# EAGLE design drsstc (EAGLE 9.2.0)
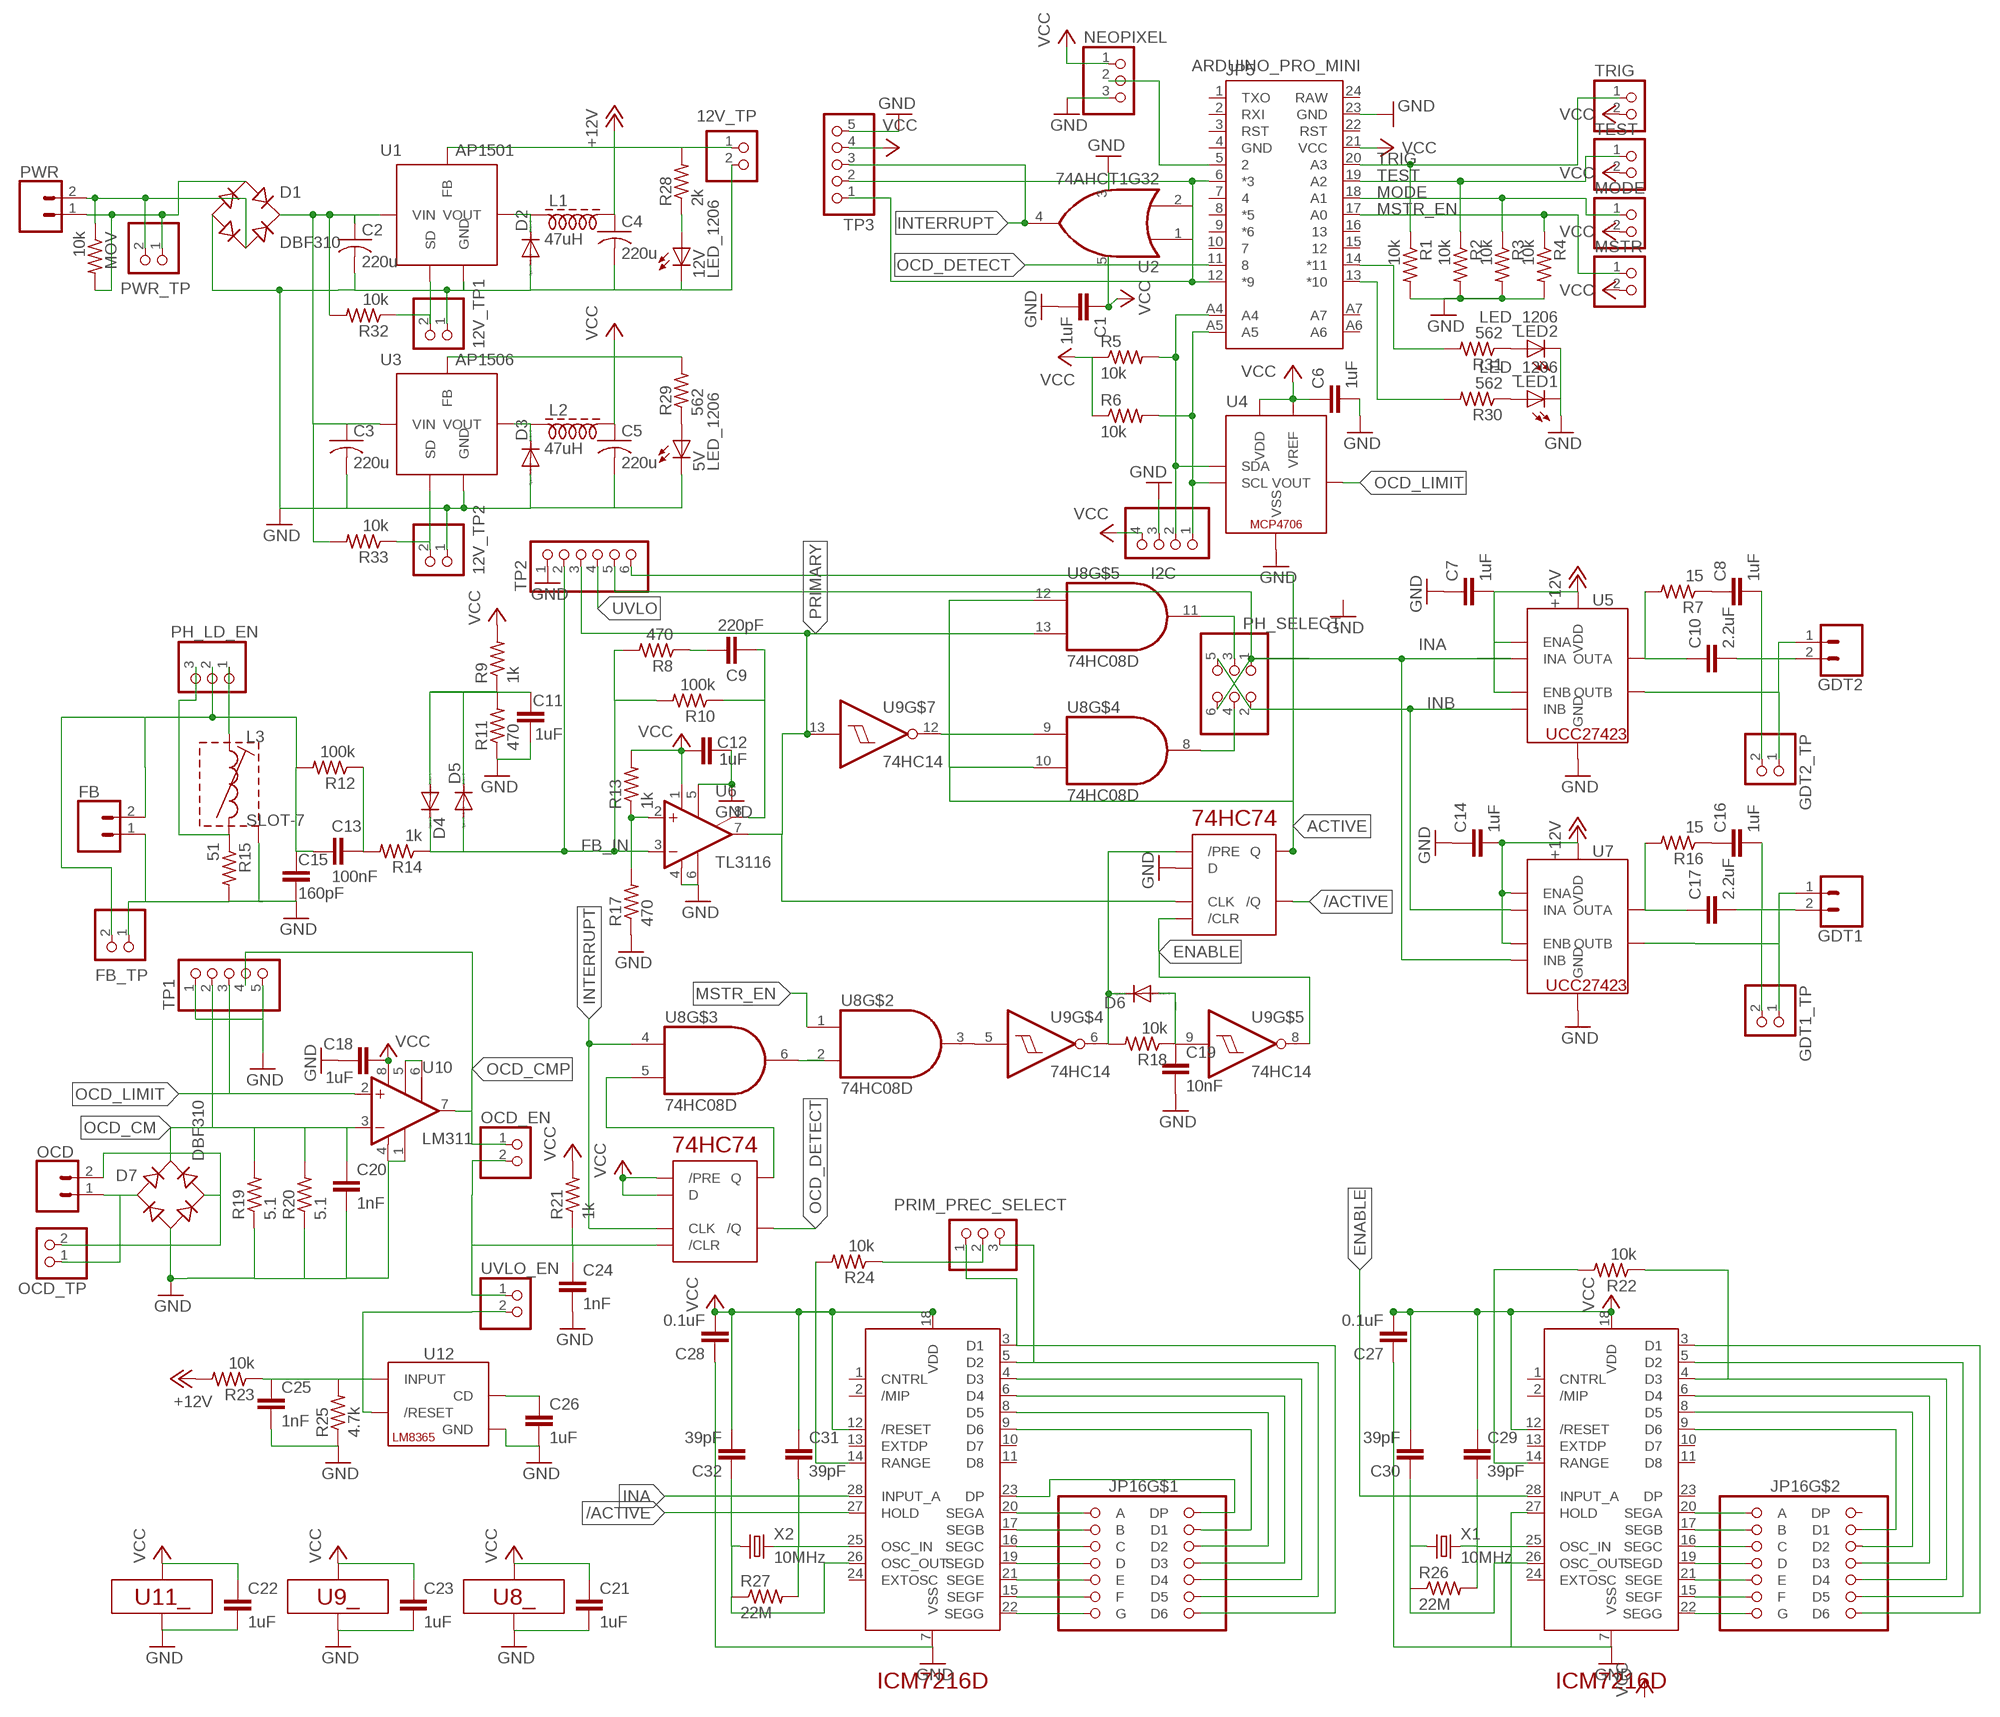
[diagram p0: schematic, sheet 1]

## Parts
5V  LED_1206  [CHIPLED_1206]
12V  LED_1206  [CHIPLED_1206]
12V_TP  PINHD-1X2  [1X02]
12V_TP1  PINHD-1X2  [1X02]
12V_TP2  PINHD-1X2  [1X02]
C1  1uF  C-EUC1206  [C1206]
C2  220u  UWT1V221MNL1GS  [CAPAE830X1050]
C3  220u  UWT1V221MNL1GS  [CAPAE830X1050]
C4  220u  UWT1V221MNL1GS  [CAPAE830X1050]
C5  220u  UWT1V221MNL1GS  [CAPAE830X1050]
C6  1uF  C-EUC1206  [C1206]
C7  1uF  C-EUC1206  [C1206]
C8  1uF  C-EUC1206  [C1206]
C9  220pF  C-EUC1206  [C1206]
C10  2.2uF  C-EUC1206  [C1206]
C11  1uF  C-EUC1206  [C1206]
C12  1uF  C-EUC1206  [C1206]
C13  100nF  C-EUC1206  [C1206]
C14  1uF  C-EUC1206  [C1206]
C15  160pF  C-EUC0402  [C0402]
C16  1uF  C-EUC1206  [C1206]
C17  2.2uF  C-EUC1206  [C1206]
C18  1uF  C-EUC1206  [C1206]
C19  10nF  C-EUC1206  [C1206]
C20  1nF  C-EUC1206  [C1206]
C21  1uF  C-EUC1206  [C1206]
C22  1uF  C-EUC1206  [C1206]
C23  1uF  C-EUC1206  [C1206]
C24  1nF  C-EUC1206  [C1206]
C25  1nF  C-EUC1206  [C1206]
C26  1uF  C-EUC1206  [C1206]
C27  0.1uF  C-EUC1206  [C1206]
C28  0.1uF  C-EUC1206  [C1206]
C29  39pF  C-EUC1206  [C1206]
C30  39pF  C-EUC1206  [C1206]
C31  39pF  C-EUC1206  [C1206]
C32  39pF  C-EUC1206  [C1206]
D1  DBF310  [4-SMD]
D2  DIODE-SMB  [SMB]
D3  DIODE-SMB  [SMB]
D4  DIODE-SMB  [SMB]
D5  DIODE-SMB  [SMB]
D6  DIODE-SMB  [SMB]
D7  DBF310  [4-SMD]
FB  CONN_025MM  [SCREWTERMINAL-5MM-2]
FB_TP  PINHD-1X2  [1X02]
GDT1  CONN_025MM  [SCREWTERMINAL-5MM-2]
GDT1_TP  PINHD-1X2  [1X02]
GDT2  CONN_025MM  [SCREWTERMINAL-5MM-2]
GDT2_TP  PINHD-1X2  [1X02]
I2C  PINHD-1X4  [1X04]
JP5  ARDUINO_PRO_MINI  [ARDUINO_PRO_MINI]
JP16  LED_HDR  [HDRRAR28W64P254_2X14_3606X850X508B]
L1  47uH  RLB9013  [RLB9013]
L2  47uH  RLB9013  [RLB9013]
L3  SLOT-7  [SLOT-7]
LED1  LED_1206  [CHIPLED_1206]
LED2  LED_1206  [CHIPLED_1206]
MODE  PINHD-1X2  [1X02]
MOV  10k  R-US_R1206  [R1206]
MSTR  PINHD-1X2  [1X02]
NEOPIXEL  PINHD-1X3  [1X03]
OCD  CONN_025MM  [SCREWTERMINAL-5MM-2]
OCD_EN  PINHD-1X2  [1X02]
OCD_TP  PINHD-1X2  [1X02]
PH_LD_EN  PINHD-1X3  [1X03]
PH_SELECT  PINHD-2X3  [2X03]
PRIM_PREC_SELECT  PINHD-1X3  [1X03]
PWR  CONN_025MM  [SCREWTERMINAL-5MM-2]
PWR_TP  PINHD-1X2  [1X02]
R1  10k  R-US_R1206  [R1206]
R2  10k  R-US_R1206  [R1206]
R3  10k  R-US_R1206  [R1206]
R4  10k  R-US_R1206  [R1206]
R5  10k  R-US_R1206  [R1206]
R6  10k  R-US_R1206  [R1206]
R7  15  R-US_R1206  [R1206]
R8  470  R-US_R1206  [R1206]
R9  1k  R-US_R1206  [R1206]
R10  100k  R-US_R1206  [R1206]
R11  470  R-US_R1206  [R1206]
R12  100k  R-US_R1206  [R1206]
R13  1k  R-US_R1206  [R1206]
R14  1k  R-US_R1206  [R1206]
R15  51  51OHM_RES  [RESAD1560W80L1200D400B]
R16  15  R-US_R1206  [R1206]
R17  470  R-US_R1206  [R1206]
R18  10k  R-US_R1206  [R1206]
R19  5.1  R-US_R1206  [R1206]
R20  5.1  R-US_R1206  [R1206]
R21  1k  R-US_R1206  [R1206]
R22  10k  R-US_R1206  [R1206]
R23  10k  R-US_R1206  [R1206]
R24  10k  R-US_R1206  [R1206]
R25  4.7k  R-US_R1206  [R1206]
R26  22M  R-US_R1206  [R1206]
R27  22M  R-US_R1206  [R1206]
R28  2k  R-US_R1206  [R1206]
R29  562  R-US_R1206  [R1206]
R30  562  R-US_R1206  [R1206]
R31  562  R-US_R1206  [R1206]
R32  10k  R-US_R1206  [R1206]
R33  10k  R-US_R1206  [R1206]
TEST  PINHD-1X2  [1X02]
TP1  PINHD-1X5  [1X05]
TP2  PINHD-1X6  [1X06]
TP3  PINHD-1X5  [1X05]
TRIG  PINHD-1X2  [1X02]
U1  AP1501  AP1501A  [TO-263-5]
U2  74AHCT1G32  [SOT353]
U3  AP1506  AP1501A  [TO-263-5]
U4  MCP4706  [SOT-23-6]
U5  UCC27423  [SOIC-8]
U6  TL3116  [SOIC-8]
U7  UCC27423  [SOIC-8]
U8  74HC08D  [SOIC-14]
U9  74HC14  [SOIC-14]
U10  LM311  [SOIC-8]
U11  74HC74  [SOIC-14]
U12  LM8365  [SOT-23-5]
U13  ICM7216D  [DIP1524W55P254L3740H635Q28B]
U14  ICM7216D  [DIP1524W55P254L3740H635Q28B]
UVLO_EN  PINHD-1X2  [1X02]
X1  10MHz  10MHZ_XTAL  [XTAL]
X2  10MHz  10MHZ_XTAL  [XTAL]

## Nets
+12V: 12V_TP.1 C4.1 C7.2 C14.2 L1.P$2 R23.2 R28.2 U1.4(FB) U5.1(ENA) U5.6(VDD) U5.8(ENB) U7.1(ENA) U7.6(VDD) U7.8(ENB)
/ACTIVE: U11.8(/Q) U14.27(HOLD)
ACTIVE: TP2.6 U8.10(I1) U8.12(I0) U11.9(Q)
D1: JP16.1(D6) PRIM_PREC_SELECT.1 U14.3(D1)
D2: JP16.2(D5) PRIM_PREC_SELECT.3 U14.5(D2)
D4: JP16.3(D4) U14.4(D3)
ENABLE: U9.8(O) U11.13(/CLR) U13.28(INPUT_A)
FB_IN: D4.C D5.A R8.2 R10.2 R14.1 TP2.2 U6.3(-IN)
GDT1_1: GDT1.1 GDT1_TP.1 U7.5(OUTB)
GDT1_2: C16.2 C17.2 GDT1.2 GDT1_TP.2
GDT2_1: GDT2.1 GDT2_TP.1 U5.5(OUTB)
GDT2_2: C8.2 C10.2 GDT2.2 GDT2_TP.2
GND: 5V.C 12V.C 12V_TP1.1 12V_TP2.1 12V_TP.2 C1.2 C2.2 C3.2 C4.2 C5.2 C6.2 C7.1 C11.1 C12.2 C14.1 C15.2 C18.1 C19.2 C20.2 C21.2 C22.2 C23.2 C24.2 C25.2 C26.2 C27.1 C28.1 D1.- D2.A D3.A D7.- FB.1 FB_TP.1 I2C.3 JP5.23(GND) L3.SHIELD_1(SHIELD) L3.SHIELD_2(SHIELD) LED1.C LED2.C NEOPIXEL.3 R1.2 R2.2 R3.2 R4.2 R11.1 R15.2 R17.1 R19.1 R20.1 R25.1 TP1.1 TP1.5 TP2.1 TP3.5 U1.3(GND) U1.6(GND) U2.3(GND) U3.3(GND) U3.6(GND) U4.2(VSS) U5.3(GND) U6.4(VCC-) U6.5(LATCH_EN) U6.6(GND) U7.3(GND) U8.7(_:GND) U9.7(_:GND) U10.1(GND) U10.4(VCC-) U11.7(_:GND) U11.12(D) U12.3(GND) U13.7(VSS) U13.27(HOLD) U14.7(VSS)
INA: PH_SELECT.1 PH_SELECT.6 TP2.5 U5.2(INA) U7.4(INB) U14.28(INPUT_A)
INB: PH_SELECT.2 PH_SELECT.5 U5.4(INB) U7.2(INA)
INTERRUPT: TP3.3 U2.4(O) U8.4(I0) U11.3(CLK)
MODE: JP5.18(A1) MODE.1 R3.1
MSTR_EN: JP5.17(A0) MSTR.1 R4.1 U8.1(I0)
N$1: D1.~2(AC2) MOV.1 PWR.2 PWR_TP.2
N$2: D7.~1(AC1) OCD.1 OCD_TP.1
N$3: JP16.13(A) U13.20(SEGA)
N$4: C26.1 U12.5(CD)
N$5: C24.1 OCD_EN.2 R21.1 U11.1(/CLR) UVLO_EN.1
N$6: C25.1 R23.1 R25.2 U12.2(INPUT)
N$7: U10.5(BAL) U10.6(BAL/S)
N$8: C19.1 D6.A R18.1 U9.9(I)
N$9: U8.9(I0) U9.12(O)
N$10: U8.5(I1) U11.5(Q)
N$11: U8.3(O) U9.5(I)
N$12: D6.C R18.2 U9.6(O) U11.10(/PRE)
N$13: JP5.5 NEOPIXEL.2
N$14: D7.~2(AC2) OCD.2 OCD_TP.2
N$15: U8.2(I1) U8.6(O)
N$16: PH_SELECT.4 U8.8(O)
N$17: PH_SELECT.3 U8.11(O)
N$18: 12V.A R28.1
N$19: JP5.6(*3) TP3.2 U2.1(I0)
N$20: C13.2 C15.1 FB.2 FB_TP.2 PH_LD_EN.2 R12.2
N$21: L3.START PH_LD_EN.3 R15.1
N$22: L3.FINISH PH_LD_EN.1
N$23: C9.2 R10.1 U6.8(/Q)
N$24: C9.1 R8.1
N$25: C11.2 D4.A D5.C R9.1 R11.2
N$26: R13.1 R17.2 U6.2(+IN)
N$27: C13.1 R12.1 R14.2
N$28: D1.~1(AC1) MOV.2 PWR.1 PWR_TP.1
N$29: C8.1 R7.1
N$30: C10.1 R7.2 U5.7(OUTA)
N$31: 5V.A R29.1
N$32: LED2.A R31.1
N$33: C16.1 R16.1
N$34: C17.1 R16.2 U7.7(OUTA)
N$35: LED1.A R30.1
N$36: 12V_TP1.2 R32.1 U1.5(SD)
N$37: JP5.12(*9) TP3.1 U2.2(I1)
N$38: C2.1 C3.1 D1.+ R32.2 R33.2 U1.1(VIN) U3.1(VIN)
N$39: D3.C L2.P$1 U3.2(VOUT)
N$40: JP5.13(*10) R30.2
N$41: D2.C L1.P$1 U1.2(VOUT)
N$42: C32.1 R27.1 U14.26(OSC_OUT) X2.P$1
N$43: JP5.14(*11) R31.2
N$44: R24.2 U14.14(RANGE)
N$45: C31.2 R27.2 U14.25(OSC_IN) X2.P$2
N$46: 12V_TP2.2 R33.1 U3.5(SD)
N$47: JP16.12(B) U13.17(SEGB)
N$48: JP16.20(C) U13.16(SEGC)
N$49: JP16.19(D) U13.19(SEGD)
N$50: JP16.18(E) U13.21(SEGE)
N$51: R22.2 U13.14(RANGE)
N$52: C29.2 R26.2 U13.25(OSC_IN) X1.P$2
N$53: C30.1 R26.1 U13.26(OSC_OUT) X1.P$1
N$55: JP16.14(F) U13.15(SEGF)
N$56: JP16.11(G) U13.22(SEGG)
N$58: JP16.15(D1) U13.9(D6)
N$59: JP16.16(D2) U13.8(D5)
N$60: JP16.17(D3) U13.6(D4)
N$61: JP16.9(D5) U13.5(D2)
N$62: JP16.8(D6) U13.3(D1)
N$63: JP16.6(A) U14.20(SEGA)
N$64: JP16.5(B) U14.17(SEGB)
N$65: JP16.27(C) U14.16(SEGC)
N$66: JP16.26(D) U14.19(SEGD)
N$67: JP16.25(E) U14.21(SEGE)
N$68: JP16.7(F) U14.15(SEGF)
N$69: JP16.4(G) U14.22(SEGG)
N$70: JP16.28(DP) U14.23(DP)
N$72: JP16.22(D1) U14.9(D6)
N$73: PRIM_PREC_SELECT.2 R24.1
N$74: JP16.10(D4) R22.1 U13.4(D3)
N$76: JP16.24(D3) U14.6(D4)
N$78: JP16.23(D2) U14.8(D5)
OCD_CM: C20.1 D7.+ R19.2 R20.2 TP1.2 U10.3(IN-)
OCD_CMP: OCD_EN.1 TP1.4 U10.7(OUT)
OCD_DETECT: JP5.11 U11.6(/Q)
OCD_LIMIT: TP1.3 U4.1(VOUT) U10.2(IN+)
PRIMARY: TP2.3 U6.7(Q) U8.13(I1) U9.13(I) U11.11(CLK)
SCL: I2C.1 JP5.A5 R6.2 U4.5(SCL)
SDA: I2C.2 JP5.A4 R5.2 U4.4(SDA)
TEST: JP5.19(A2) R2.1 TEST.1
TRIG: JP5.20(A3) R1.1 TRIG.1
UVLO: TP2.4 U12.1(/RESET) UVLO_EN.2
VCC: C1.1 C5.1 C6.1 C12.1 C18.2 C21.1 C22.1 C23.1 C27.2 C28.2 C29.1 C30.2 C31.1 C32.2 I2C.4 JP5.21(VCC) L2.P$2 MODE.2 MSTR.2 NEOPIXEL.1 R5.1 R6.1 R9.2 R13.2 R21.2 R29.2 TEST.2 TP3.4 TRIG.2 U2.5(VCC) U3.4(FB) U4.3(VDD) U4.6(VREF) U6.1(VCC+) U8.14(_:VCC) U9.14(_:VCC) U10.8(VCC+) U11.2(D) U11.4(/PRE) U11.14(_:VCC) U13.12(/RESET) U13.18(VDD) U14.12(/RESET) U14.18(VDD)
Unconnected: JP5.1(TXO) JP5.2(RXI) JP5.3(RST) JP5.7 JP5.8(*5) JP5.9(*6) JP5.10 JP5.15 JP5.16 JP5.22(RST) JP5.A6 JP5.A7 JP16.21(DP) U9.1(I) U9.2(O) U9.3(I) U9.4(O) U9.10(O) U9.11(I) U13.1(CNTRL) U13.2(/MIP) U13.10(D7) U13.11(D8) U13.13(EXTDP) U13.23(DP) U13.24(EXTOSC) U14.1(CNTRL) U14.2(/MIP) U14.10(D7) U14.11(D8) U14.13(EXTDP) U14.24(EXTOSC)

## Power pins joined to a net without a drawn wire
GND: JP5.4(GND)
RAW: JP5.24(RAW)

## Library data of the parts
5V 12V LED1 LED2 = nixie_ticker:LED_1206
12V_TP 12V_TP1 12V_TP2 FB_TP GDT1_TP GDT2_TP MODE MSTR OCD_EN OCD_TP PWR_TP TEST TRIG UVLO_EN = pinhead:PINHD-1X2: PIN HEADER
C1 C6-C32 = resistor:C-EU: CAPACITOR, European symbol
C2-C5 = drsstc:UWT1V221MNL1GS
D1 D7 = drsstc:DBF310
D2-D6 = diode:DIODE-: DIODE
FB GDT1 GDT2 OCD PWR = SparkFun-Connectors:CONN_02: Multi connection point. Often used as Generic Header-pin footprint for 0.1 inch spaced/style header connections On any of the 0.1 inch spaced packages, you can populate with these: Break Away Headers - Straight <https://www.sparkfun.com/products/116> (PRT-00116) Break Away Male Headers - Right Angle <https://www.sparkfun.com/products/553> (PRT-00553) Female Headers <https://www.sparkfun.com/products/115> (PRT-00115) Break Away Headers - Machine Pin <https://www.sparkfun.com/products/117> (PRT-00117) Break Away Female Headers - Swiss Machine Pin <https://www.sparkfun.com/products/743> (PRT-00743) For SCREWTERMINALS and SPRING TERMINALS visit here: Screw Terimnals on SparkFun.com <https://www.sparkfun.com/search/results?term=Screw+Terminals> (5mm/3.5mm/2.54mm spacing) This device is also useful as a general connection point to wire up your design to another part of your project. Our various solder wires solder well into these plated through hole pads. Hook-Up Wire - Assortment (Stranded, 22 AWG) <https://www.sparkfun.com/products/11375> (PRT-11375) Hook-Up Wire - Assortment (Solid Core, 22 AWG) <https://www.sparkfun.com/products/11367> (PRT-11367) View the entire wire category on our website here <https://www.sparkfun.com/categories/141> Special notes: Molex polarized connector foot print use with: PRT-08233 with associated crimp pins and housings. 2.54_SCREWTERM for use with PRT-10571. 3.5mm Screw Terminal footprints for PRT-08084 5mm Screw Terminal footprints for use with PRT-08432; SF_SKU: PRT-08432
I2C = pinhead:PINHD-1X4: PIN HEADER
JP5 = drsstc:ARDUINO_PRO_MINI
JP16 = drsstc:LED_HDR
L1 L2 = nixie_ticker:RLB9013
L3 = drsstc:SLOT-7
MOV R1-R14 R16-R33 = resistor:R-US_: RESISTOR, American symbol
NEOPIXEL PH_LD_EN PRIM_PREC_SELECT = pinhead:PINHD-1X3: PIN HEADER
PH_SELECT = pinhead:PINHD-2X3: PIN HEADER
R15 = drsstc:51OHM_RES
TP1 TP3 = pinhead:PINHD-1X5: PIN HEADER
TP2 = pinhead:PINHD-1X6: PIN HEADER
U1 U3 = drsstc:AP1501A
U2 = drsstc:74AHCT1G32
U4 = drsstc:MCP4706
U5 U7 = drsstc:UCC27423
U6 = drsstc:TL3116
U8 = drsstc:74HC08D
U9 = drsstc:74HC14
U10 = drsstc:LM311
U11 = drsstc:74HC74
U12 = drsstc:LM8365
U13 U14 = teslacoil:ICM7216D
X1 X2 = drsstc:10MHZ_XTAL

## Board
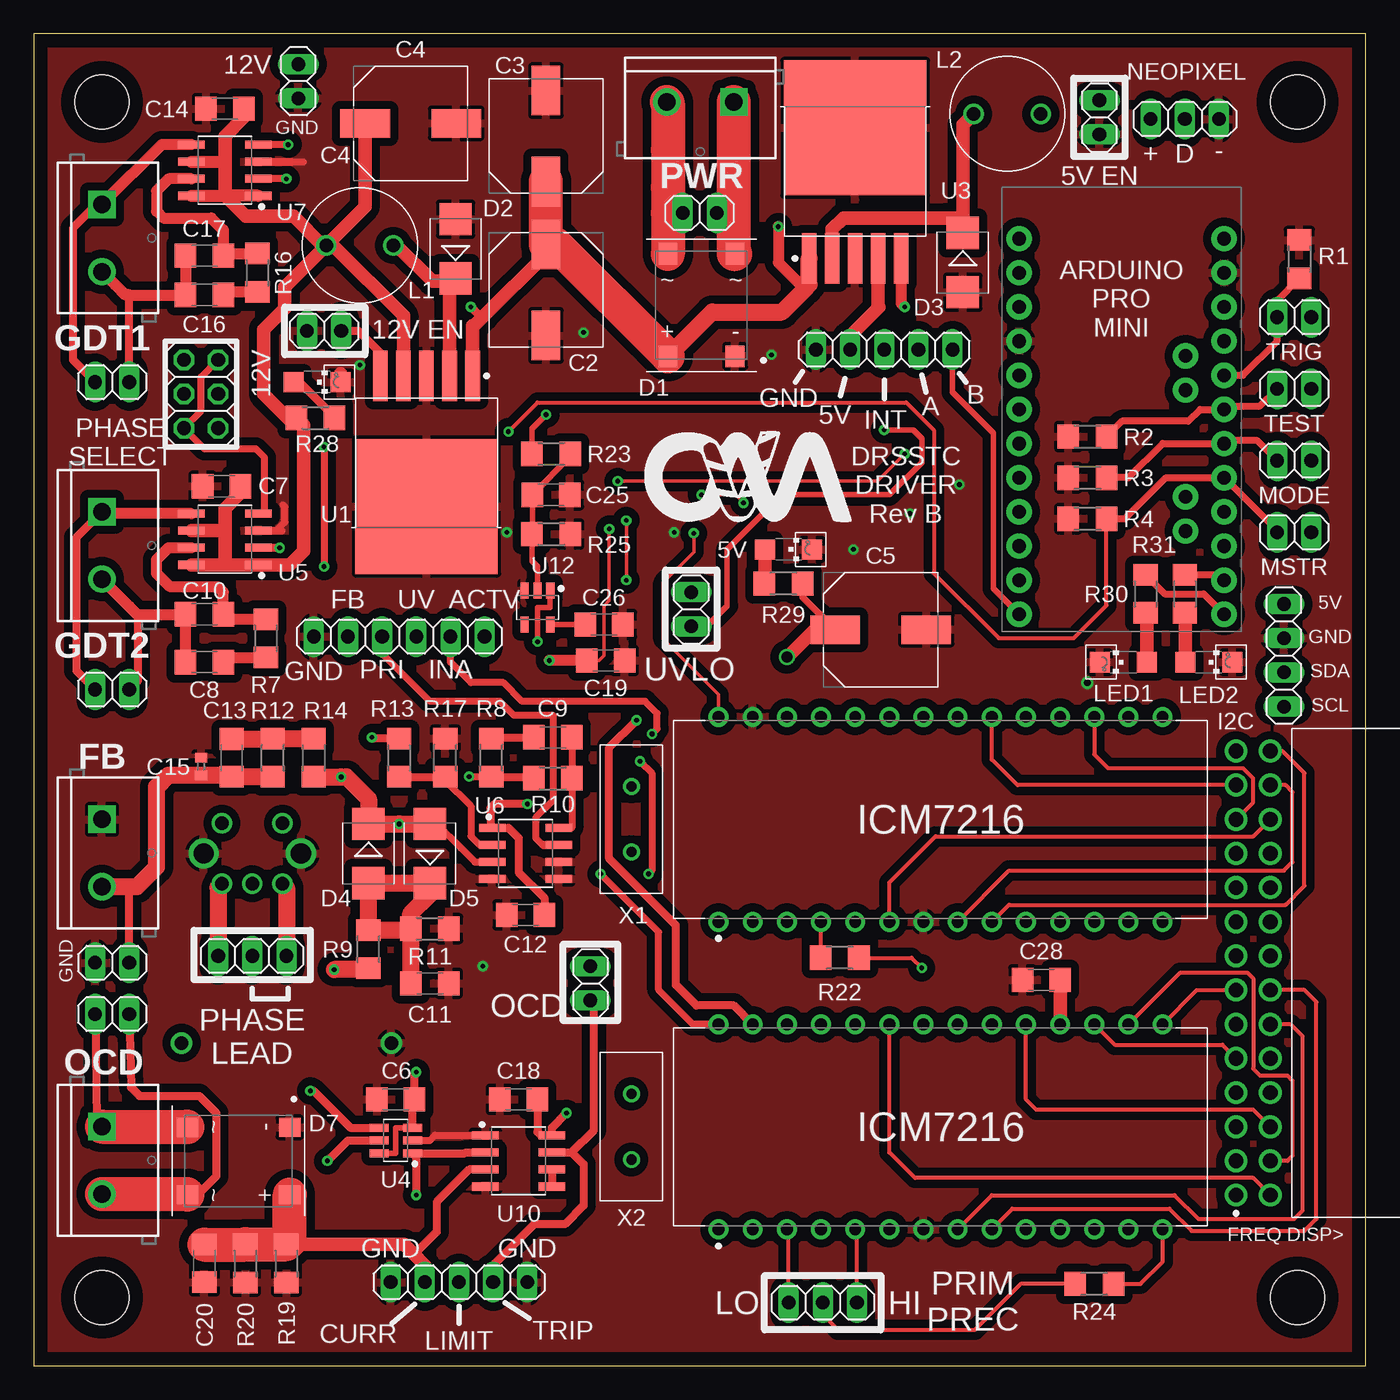
[diagram p1: board, top side]
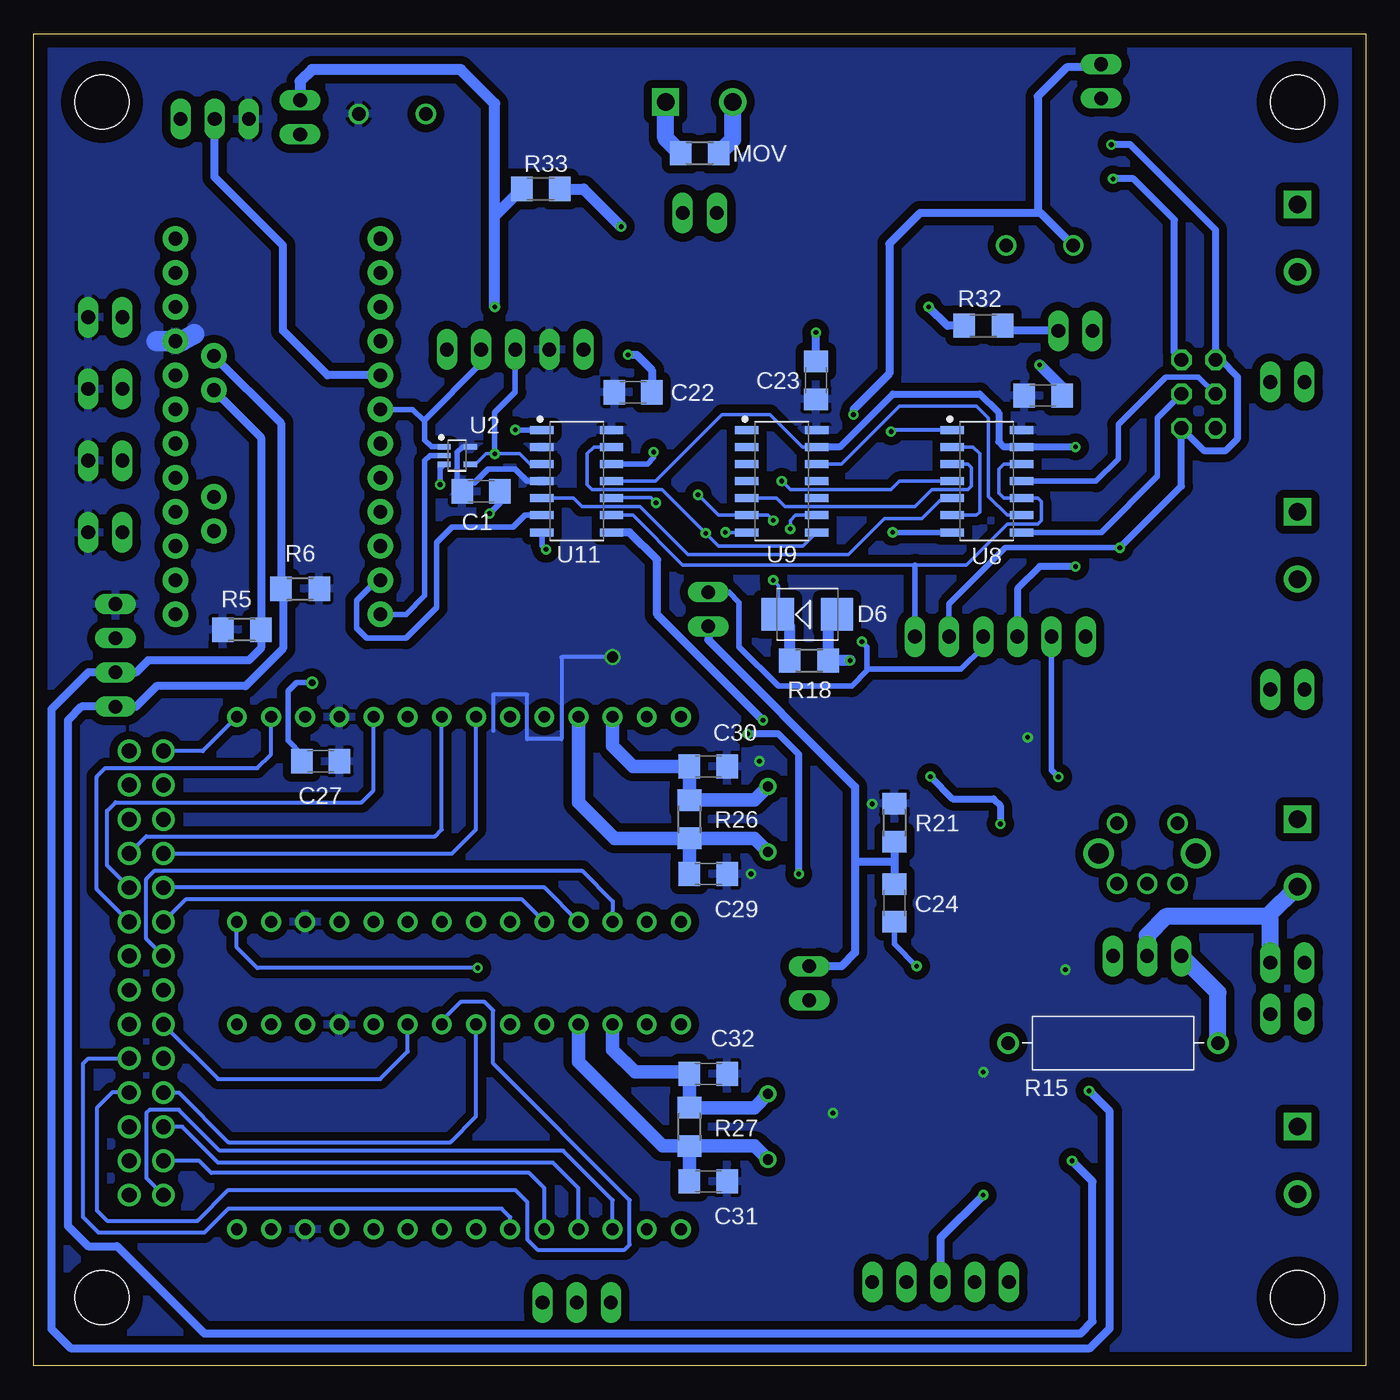
[diagram p2: board, bottom side, seen from below]

Size 99.06 x 99.06 mm. Coordinates in mm from the lower left corner, seen from the top.
Outline: 0,0 99.06,0 99.06,99.06 0,99.06 0,0
Copper layers (1*16): Top 0.035mm / dielectric 1.5mm / Bottom 0.035mm
Design rules "default *": minimum track width 6mil, minimum drill 0.35mm, track to track 6mil, track to pad 6mil, pad to pad 6mil, via to via 6mil, smd to smd 6mil, copper to edge 40mil, drill to drill 6mil, minimum pad ring 10mil, minimum via ring 8mil, stop-mask expansion 4mil, vias tented up to drill 25mil, thermal gap 10mil
Holes 4 mm at 5.08,5.08 5.08,93.98 93.98,93.98 93.98,5.08

### Footprints (pad centres in the part's own frame; a part is rotated, then mirrored left to right if it is on the bottom)
CHIPLED_1206 = smd 1.5 x 1.5: A 0,-1.75; C 0,1.75
1X02 = drill 1.016 long: 1 -1.27,0; 2 1.27,0
C1206 = smd 1.6 x 1.8: 1 -1.4,0; 2 1.4,0
CAPAE830X1050 = smd 3.687 x 2.12: 1 -3.388,0; 2 3.388,0
C0402 = smd 0.7 x 0.9: 1 -0.65,0; 2 0.65,0
4-SMD = smd 1.4 x 1.6: + 2.5,3.8; - -2.5,3.8; ~1 -2.5,-3.8; ~2 2.5,-3.8
SMB = smd 2.4 x 2.4: A 2.2,0; C -2.2,0
SCREWTERMINAL-5MM-2 = drill 1.3 pad 2.032 square: 1 0,0 | drill 1.3 pad 2.032: 2 5,0
1X04 = drill 1.016 long: 1 -3.81,0; 2 -1.27,0; 3 1.27,0; 4 3.81,0
ARDUINO_PRO_MINI = drill 1.016 pad 1.88: 1 -7.62,12.7; 2 -7.62,10.16; 3 -7.62,7.62; 4 -7.62,5.08; 5 -7.62,2.54; 6 -7.62,0; 7 -7.62,-2.54; 8 -7.62,-5.08; 9 -7.62,-7.62; 10 -7.62,-10.16; 11 -7.62,-12.7; 12 -7.62,-15.24; 13 7.62,-15.24; 14 7.62,-12.7; 15 7.62,-10.16; 16 7.62,-7.62; 17 7.62,-5.08; 18 7.62,-2.54; 19 7.62,0; 20 7.62,2.54; 21 7.62,5.08; 22 7.62,7.62; 23 7.62,10.16; 24 7.62,12.7; A4 4.763,1.429; A5 4.763,3.969; A6 4.763,-9.049; A7 4.763,-6.509
HDRRAR28W64P254_2X14_3606X850X508B = drill 1.105 pad 1.705: 1 0,0; 2 2.54,0; 3 5.08,0; 4 7.62,0; 5 10.16,0; 6 12.7,0; 7 15.24,0; 8 17.78,0; 9 20.32,0; 10 22.86,0; 11 25.4,0; 12 27.94,0; 13 30.48,0; 14 33.02,0; 15 33.02,-2.54; 16 30.48,-2.54; 17 27.94,-2.54; 18 25.4,-2.54; 19 22.86,-2.54; 20 20.32,-2.54; 21 17.78,-2.54; 22 15.24,-2.54; 23 12.7,-2.54; 24 10.16,-2.54; 25 7.62,-2.54; 26 5.08,-2.54; 27 2.54,-2.54; 28 0,-2.54
RLB9013 = drill 1: P$1 0,2.5; P$2 0,-2.5
SLOT-7 = drill 1: FINISH -2.248,2.25; NC1 0,2.25; NC2 -2.248,-2.25; NC3 2.248,-2.25; START 2.248,2.25 | drill 1.5: SHIELD_1 -3.62,0; SHIELD_2 3.62,0
R1206 = smd 1.6 x 1.803: 1 -1.422,0; 2 1.422,0
1X03 = drill 1.016 long: 1 -2.54,0; 2 0,0; 3 2.54,0
2X03 = drill 1.016 octagon: 1 -2.54,-1.27; 2 -2.54,1.27; 3 0,-1.27; 4 0,1.27; 5 2.54,-1.27; 6 2.54,1.27
RESAD1560W80L1200D400B = drill 1 pad 1.6: 1 -7.8,0; 2 7.8,0
1X05 = drill 1.016 long: 1 -5.08,0; 2 -2.54,0; 3 0,0; 4 2.54,0; 5 5.08,0
1X06 = drill 1.016 long: 1 -6.35,0; 2 -3.81,0; 3 -1.27,0; 4 1.27,0; 5 3.81,0; 6 6.35,0
TO-263-5 = smd 3.725 x 1.097: 1 -6.43,3.42; 2 -6.43,1.71; 3 -6.43,0; 4 -6.43,-1.71; 5 -6.43,-3.42 | smd 10.02 x 10.608: 6 3.283,0
SOT353 = smd 0.973 x 0.389: 1 -0.978,0.65; 2 -0.978,0; 3 -0.978,-0.65; 4 0.978,-0.65; 5 0.978,0.65
SOT-23-6 = smd 1.412 x 0.59: 1 -1.247,0.95; 2 -1.247,0; 3 -1.247,-0.95; 4 1.247,-0.95; 5 1.247,0; 6 1.247,0.95
SOIC-8 = smd 1.968 x 0.602: 1 -2.473,1.905; 2 -2.473,0.635; 3 -2.473,-0.635; 4 -2.473,-1.905; 5 2.473,-1.905; 6 2.473,-0.635; 7 2.473,0.635; 8 2.473,1.905
SOIC-14 = smd 1.746 x 0.592: 1 -2.585,3.81; 2 -2.585,2.54; 3 -2.585,1.27; 4 -2.585,0; 5 -2.585,-1.27; 6 -2.585,-2.54; 7 -2.585,-3.81; 8 2.585,-3.81; 9 2.585,-2.54; 10 2.585,-1.27; 11 2.585,0; 12 2.585,1.27; 13 2.585,2.54; 14 2.585,3.81
SOT-23-5 = smd 1.193 x 0.609: 1 -1.261,0.95; 2 -1.261,0; 3 -1.261,-0.95; 4 1.261,-0.95; 5 1.261,0.95
DIP1524W55P254L3740H635Q28B = drill 0.876 pad 1.476: 1 -7.62,16.51; 2 -7.62,13.97; 3 -7.62,11.43; 4 -7.62,8.89; 5 -7.62,6.35; 6 -7.62,3.81; 7 -7.62,1.27; 8 -7.62,-1.27; 9 -7.62,-3.81; 10 -7.62,-6.35; 11 -7.62,-8.89; 12 -7.62,-11.43; 13 -7.62,-13.97; 14 -7.62,-16.51; 15 7.62,-16.51; 16 7.62,-13.97; 17 7.62,-11.43; 18 7.62,-8.89; 19 7.62,-6.35; 20 7.62,-3.81; 21 7.62,-1.27; 22 7.62,1.27; 23 7.62,3.81; 24 7.62,6.35; 25 7.62,8.89; 26 7.62,11.43; 27 7.62,13.97; 28 7.62,16.51
XTAL = drill 0.75: P$1 -2.44,0; P$2 2.44,0

### Placement (x,y rotation side)
5V  56.13,60.71 270 top
12V  21.08,73.15 270 top
12V_TP  19.68,95.52 270 top
12V_TP1  21.59,76.96 0 top
12V_TP2  79.25,92.84 90 top
C1  65.79,65.02 0 bottom
C2  38.1,80.01 270 top
C3  38.1,91.44 90 top
C4  28.04,92.39 0 top
C5  62.99,54.74 0 top
C6  26.92,19.81 180 top
C7  13.97,65.41 0 top
C8  12.7,52.32 180 top
C9  38.61,46.74 0 top
C10  12.7,55.88 180 top
C11  29.46,28.45 180 top
C12  36.58,33.53 180 top
C13  14.73,45.21 270 top
C14  14.22,93.47 0 top
C15  12.45,44.58 90 top
C16  12.7,79.63 180 top
C17  12.7,82.55 180 top
C18  36.07,19.81 0 top
C19  42.55,52.45 0 top
C20  12.7,7.62 270 top
C21  24,72.14 0 bottom
C22  54.48,72.39 0 bottom
C23  40.89,73.28 90 bottom
C24  35.05,34.42 270 bottom
C25  38.48,64.77 0 top
C26  42.42,55.12 0 top
C27  77.72,44.96 0 bottom
C28  74.93,28.7 0 top
C29  48.9,36.58 180 bottom
C30  48.9,44.58 0 bottom
C31  48.9,13.72 180 bottom
C32  48.9,21.72 0 bottom
D1  49.66,78.87 180 top
D2  31.37,83.06 90 top
D3  69.09,82.04 270 top
D4  24.89,38.1 270 top
D5  29.46,38.1 90 top
D6  41.53,55.88 0 bottom
D7  15.24,15.24 270 top
FB  5.08,40.64 270 top
FB_TP  5.84,29.97 0 top
GDT1  5.08,86.36 270 top
GDT1_TP  5.84,73.15 0 top
GDT2  5.08,63.5 270 top
GDT2_TP  5.84,50.29 0 top
I2C  92.96,52.83 90 top
JP5  80.9,71.12 0 top
JP16  89.41,12.7 90 top
L1  24.26,83.31 270 top
L2  72.39,93.09 90 top
L3  16.26,38.1 180 top
LED1  81.03,52.32 90 top
LED2  87.38,52.32 270 top
MODE  93.73,67.31 0 top
MOV  49.53,90.17 180 bottom
MSTR  93.73,61.98 0 top
NEOPIXEL  85.6,92.71 0 top
OCD  5.08,17.78 270 top
OCD_EN  41.4,28.45 90 top
OCD_TP  5.84,26.16 0 top
PH_LD_EN  16.26,30.48 180 top
PH_SELECT  12.45,72.26 270 top
PRIM_PREC_SELECT  58.67,4.7 0 top
PWR  52.07,93.98 180 top
PWR_TP  49.53,85.72 180 top
R1  94.11,82.3 90 top
R2  78.36,69.09 180 top
R3  78.36,66.04 180 top
R4  78.36,62.99 180 top
R5  83.57,54.74 0 bottom
R6  79.25,57.78 180 bottom
R7  17.27,54.1 90 top
R8  34.04,45.21 270 top
R9  24.89,30.99 270 top
R10  38.61,43.69 180 top
R11  29.46,32.51 180 top
R12  17.78,45.21 270 top
R13  27.18,45.21 90 top
R14  20.83,45.21 90 top
R15  18.8,24 180 bottom
R16  16.64,81.28 90 top
R17  30.61,45.21 270 top
R18  41.4,52.45 180 bottom
R19  18.8,7.62 90 top
R20  15.75,7.62 90 top
R21  35.05,40.39 90 bottom
R22  59.94,30.35 0 top
R23  38.48,67.82 180 top
R24  78.87,6.1 0 top
R25  38.48,61.85 180 top
R26  50.29,40.64 270 bottom
R27  50.29,17.78 270 bottom
R28  20.95,70.48 180 top
R29  55.75,58.17 0 top
R30  82.68,57.4 90 top
R31  85.6,57.4 90 top
R32  28.45,77.34 180 bottom
R33  61.34,87.5 0 bottom
TEST  93.73,72.64 0 top
TP1  31.62,6.22 0 top
TP2  27.18,54.23 0 top
TP3  63.25,75.56 180 top
TRIG  93.73,77.98 0 top
U1  29.21,67.18 270 top
U2  67.56,67.69 0 bottom
U3  61.09,88.77 90 top
U4  26.92,16.76 180 top
U5  14.22,61.47 180 top
U6  36.58,38.1 0 top
U7  14.22,88.9 180 top
U8  28.19,65.79 0 bottom
U9  43.43,65.79 0 bottom
U10  36.07,15.24 0 top
U11  58.67,65.79 0 bottom
U12  37.47,56.39 270 top
U13  67.44,40.64 90 top
U14  67.44,17.78 90 top
UVLO_EN  48.9,56.26 90 top
X1  44.45,40.64 270 top
X2  44.45,17.78 270 top

### Tracks (layer width: path | path; a pad name or v marks a point on that pad's centre or on a via)
+12V  (via drill 0.35)
  Top 0.406: R23.2 37.06,69.7 v38.1,70.74
  Top 0.889: U7.6 14.22,89.53 | U7.8 14.22,87 U7.1
  Top 1.016: C14.2 15.62,92.84 14.22,91.44 14.22,89.53 14.22,87 15.75,85.47 19.34,85.47 21.5,83.31 | U5.8 14.22,59.56 | 14.22,59.56 U5.1 19.05,59.56 20.07,60.58 20.07,69.95 R28.2 18.9,70.48 17.12,72.26 17.12,77.06 18.67,78.61 18.67,80.22 L1.P$2 | U5.6 14.22,62.1 | 14.22,62.1 14.22,59.56 | 14.22,62.1 14.22,63.75 15.37,64.9 C7.2 | U1.4 27.5,78.08 22.27,83.31 L1.P$2 | L1.P$2 24.65,86.2 C4.1
  Top 1.27: 21.5,83.31 L1.P$2
  Bottom 0.406: 24.17,85.72 24.4,85.72
  Bottom 0.61: L1.P$2 24.17,85.72 | v38.1,70.74 38.1,71.12 35.43,73.79 35.43,83.44 33.15,85.72 24.4,85.72 24.4,94.4 22.24,96.56 19.91,96.56 12V_TP.1
/ACTIVE  (via drill 0.35)
  Top 0.61: U14.27 52.07,26.8 49.28,26.8 47.75,28.32 47.75,32.77 42.8,37.72 42.8,45.97 v44.83,48.01
  Bottom 0.61: v44.83,48.01 52.7,55.88 52.7,59.94 54.74,61.98 U11.8
ACTIVE
  Bottom 0.254: U8.12 26.92,67.06 27.3,66.67 27.3,64.9 26.92,64.52 U8.10 24.38,64.52 24.13,64.26 24.13,62.87 24.38,62.61 26.67,62.61 29.72,59.56 30.99,59.56 31.11,59.56 31.62,59.56 33.53,59.56 50.8,59.56 54.48,63.25 U11.9
  Bottom 0.406: TP2.6 33.53,59.56
D1
  Top 0.305: PRIM_PREC_SELECT.1 56.13,10.03 U14.3
  Bottom 0.305: JP16.1 90.68,13.97 90.68,18.8 90.42,19.05 88.27,19.05 85.22,16 59.69,16 56.01,12.32 U14.3
D2
  Top 0.305: PRIM_PREC_SELECT.3 61.21,10.03 U14.5
  Bottom 0.305: JP16.2 86.74,15.24 85.85,14.35 62.23,14.35 61.09,13.21 U14.5
D4
  Bottom 0.305: JP16.3 88.01,17.78 85.34,15.11 60.45,15.11 58.55,13.21 U14.4
ENABLE  (via drill 0.35)
  Top 0.254: U13.28 50.93,49.91 46.8,54.04 46.8,58.23 49.09,60.52 v49.09,61.91
  Bottom 0.254: U9.8 41.87,60.96 48.13,60.96 v49.09,61.91 52.32,65.15 57.53,65.15 57.91,65.53 57.91,67.82 57.4,68.33 U11.13
FB_IN  (via drill 0.35)
  Top 0.508: D5.A 29.97,40.3 31.77,38.5 32.81,37.47 U6.3 | R8.2 32.41,43.79 v32.38,43.81
  Top 0.61: R10.2 37.08,43.79 R8.2 33.63,43.79
  Top 1.27: R14.1 v22.86,43.79 23.27,43.79 24.89,42.16 D4.C v27.18,40.3 D5.A
  Bottom 0.406: TP2.2 23.37,44.3 v22.86,43.79
  Bottom 0.508: v32.38,43.81 30.73,42.16 27.69,42.16 27.18,41.66 v27.18,40.3
GDT1_1
  Top 0.61: GDT1.1 4.7,86.36 2.92,84.58 2.92,74.8 GDT1_TP.1
  Top 0.813: U7.5 9.53,90.81 GDT1.1
GDT1_2
  Top 0.61: GDT1_TP.2 7.11,79.76 6.68,79.76
  Top 0.813: C17.2 C16.2 6.81,79.63 6.05,80.39 | 6.05,80.39 6.68,79.76 | GDT1.2 6.05,80.39
GDT2_1
  Top 0.61: GDT2.1 3.17,61.59 3.17,51.69 GDT2_TP.1
  Top 0.813: U5.5 5.08,63.37 GDT2.1
GDT2_2
  Top 0.61: 7.75,55.83 7.75,50.93 GDT2_TP.2
  Top 0.813: C8.2 C10.2 7.7,55.88 7.11,56.47 | 7.11,56.47 7.75,55.83 | GDT2.2 7.11,56.47
GND  (via drill 0.35, 0.5)
  Top 0.508: U4.2 29.46,16.76 29.84,17.14 U10.1 | U5.3 18.03,62.1 18.67,62.74 18.67,63.88 18.54,64.01 | 19.18,89.53 20.07,89.53
  Top 0.61: U5.3 18.41,62.1 | U7.3 19.18,89.53
  Top 1.016: 22.83,73.79 12V.C
  Bottom 0.254: U9.7 v47.62,61.98
  Bottom 0.406: U8.7 v35.18,61.98 | U11.7 61.26,61.01 v60.96,60.71 | U11.12 53.42,67.06 52.96,67.52 v52.96,67.94 | C27.1 79.12,45.47 80.14,46.48 80.14,50.16 79.5,50.8 v78.36,50.8 | U2.3 68.83,66.75 v68.83,65.53 | C1.2 64.39,64.14 v65.15,63.37 | C24.2 35.05,31.37 v33.4,29.72
  Bottom 0.61: C23.2 v40.89,76.83 | v54.86,75.18 54.23,75.18 53.08,74.04 C22.2
  Bottom 0.813: v24.26,74.42 22.6,72.77 C21.2
  pour Top (isolate 0.61, rank 4): 0,0 99.06,0 99.06,99.06 0,99.06
INA  (via drill 0.35)
  Top 0.508: U14.28 49.02,25.4 46.48,27.94 46.48,32.26 v42.16,36.58 | TP2.5 30.99,52.32 32.51,50.8 34.92,50.8 36.32,49.4 45.47,49.4 46.35,48.51 46.35,47.37 v45.97,46.99 | v18.92,90.81 U7.4
  Top 0.61: U5.2 v18.29,60.83
  Bottom 0.406: v18.29,60.83 26.8,60.83 30.99,56.64 TP2.5
  Bottom 0.508: v18.29,60.83 13.72,65.41 PH_SELECT.6 12.06,68.07 10.41,68.07 9.53,68.96 9.53,73.53 10.79,74.8 PH_SELECT.1 11.18,84.45 17.53,90.81 v18.92,90.81 | v42.16,36.58 42.16,45.47 43.69,46.99 v45.97,46.99
INB  (via drill 0.35)
  Top 0.508: U5.4 17.14,63.37 17.14,67.56 16.51,68.2 12.7,68.2 PH_SELECT.5 12.45,70.99 12.45,73.53 PH_SELECT.2 | v18.8,88.27 U7.2
  Bottom 0.508: PH_SELECT.2 14.22,75.31 14.22,85.22 17.27,88.27 v18.8,88.27
INTERRUPT  (via drill 0.35)
  Top 0.254: v43.43,65.79 62.74,65.79 v64.77,67.82
  Bottom 0.254: U8.4 34.67,65.79 35.31,65.15 42.8,65.15 v43.43,65.79 | U11.3 62.15,67.06 62.91,67.82 v64.77,67.82 65.43,67.82 66.2,67.04 U2.4
  Bottom 0.406: v64.77,67.82 64.77,70.87 63.25,72.39 TP3.3
MODE
  Top 0.508: R3.1 81.41,66.04 83.95,68.58 JP5.18 88.77,68.83 90.93,68.83 MODE.1
MSTR_EN  (via drill 0.35)
  Top 0.305: v35.31,69.47 37.47,71.63 64.9,71.63 66.93,69.6 66.93,58.93 71.75,54.1 77.34,54.1 79.78,56.54 R4.1
  Top 0.508: R4.1 81.15,62.99 84.2,66.04 JP5.17 92.46,62.1 MSTR.1
  Bottom 0.305: U8.1 35.18,69.6 v35.31,69.47
N$1
  Top 1.27: PWR_TP.2 47.16,85.72
  Top 2.54: PWR.2 47.16,93.89 47.16,90.42 47.16,87.63 47.16,85.72 D1.~2
  Bottom 1.27: MOV.1 47.07,91.21 PWR.2
N$2
  Top 0.61: OCD_TP.1 4.7,18.16 OCD.1
  Top 2.54: OCD.1 11.4,17.78 D7.~1
N$3
  Top 0.305: JP16.13 73.15,43.18 71.25,45.09 U13.20
N$4
  Top 0.406: U12.5 C26.1
N$5  (via drill 0.35)
  Top 0.406: UVLO_EN.1 50.04,54.99 51.56,56.52 51.56,60.71 55.63,64.77 63.63,64.77 66.04,67.18 66.04,68.96 65.41,69.6 v63.25,69.6
  Bottom 0.406: v63.25,69.6 U11.1
  Bottom 0.61: UVLO_EN.1 48.9,53.98 37.97,43.05 37.97,37.59 37.97,37.47 | OCD_EN.2 38.99,29.72 37.97,30.73 37.97,37.47 | R21.1 35.05,37.59 35.05,37.47 | 35.05,37.47 37.97,37.47 | 35.05,37.47 C24.1
N$6
  Top 0.406: R23.1 39.9,67.59 C25.1 37.08,61.87 R25.2 37.06,59.84 37.47,59.44 U12.2
N$7
  Top 0.61: U10.6 U10.5
N$8  (via drill 0.35)
  Top 0.254: v42.8,62.23 42.8,56.9 42.42,56.52 42.42,52.83 42.04,52.45 C19.1
  Top 0.813: C19.1 v38.35,52.45
  Bottom 0.254: U9.9 42.42,63.25 42.8,62.87 v42.8,62.23
  Bottom 0.813: v38.35,52.45 R18.1 39.98,55.23 D6.A
N$9
  Bottom 0.254: U8.9 26.67,63.25 28.07,64.64 28.07,70.48 28.96,71.37 34.67,71.37 38.99,67.06 U9.12
N$10
  Bottom 0.254: U8.5 31.5,64.52 33.02,62.99 35.81,62.99 38.48,60.33 50.42,60.33 53.98,63.88 58.29,63.88 58.93,64.52 U11.5
N$11
  Bottom 0.254: U8.3 29.59,67.06 29.34,66.8 29.34,65.41 29.59,65.15 32.26,65.15 33.53,63.88 43.18,63.88 43.81,64.52 U9.5
N$12  (via drill 0.35)
  Top 0.254: v44.07,62.87 v44.07,58.42 | v49.66,64.77 52.2,64.77 v52.79,64.18
  Bottom 0.254: v44.07,62.87 44.45,63.25 U9.6 48.13,63.25 v49.66,64.77 | v52.79,64.18 53.17,64.56 56.05,64.56 U11.10 | v44.07,58.42 43.69,58.04 43.69,55.92 D6.C
  Bottom 0.813: D6.C 42.82,54.98 R18.2
N$13
  Bottom 0.61: JP5.5 77.22,73.66 80.52,76.96 80.52,83.31 85.6,88.39 NEOPIXEL.2
N$14
  Top 0.61: OCD_TP.2 7.24,20.7 7.87,20.07 12.32,20.07 13.59,18.8 13.59,14.1 12.27,12.78 11.4,12.78
  Top 2.54: OCD.2 11.4,12.78 D7.~2
N$15
  Bottom 0.254: U8.2 29.21,68.33 28.7,67.82 28.7,63.5 28.96,63.25 U8.6
N$16
  Bottom 0.406: PH_SELECT.4 15.49,70.48 15.49,66.17 19.68,61.98 U8.8
N$17
  Bottom 0.406: PH_SELECT.3 12.45,73.53 14.86,73.53 18.41,69.98 18.41,67.44 20.07,65.79 U8.11
N$18
  Top 0.61: 12V.A 19.79,73.15 22.38,70.56 R28.1
N$19
  Bottom 0.406: U2.1 69.48,68.34 69.98,68.83 69.98,70.23 70.04,70.29 | 70.04,70.29 70.87,71.12 JP5.6 | 70.04,70.29 65.79,74.55 TP3.2
N$20
  Top 0.61: FB_TP.2 7.11,35.51 6.99,35.64
  Top 1.27: FB.2 6.99,35.64 7.7,35.64 9.14,37.08 9.14,43.05 10.02,43.93 C15.1 14.62,43.93 C13.2 17.76,43.81 R12.2
  Bottom 1.27: FB.2 7.32,33.4 | 7.32,33.4 14.86,33.4 16.26,32 PH_LD_EN.2 | FB_TP.2 7.11,33.19 7.32,33.4
N$21
  Top 1.27: L3.START 13.72,35.56 PH_LD_EN.3
  Bottom 1.27: R15.1 11,27.76 PH_LD_EN.3
N$22
  Top 1.27: L3.FINISH 18.8,35.56 PH_LD_EN.1
N$23
  Top 0.508: 40.03,46.71 R10.1 40.03,40.03 40.01,40.01 U6.8
  Top 0.61: C9.2 40.03,46.71
N$24
  Top 0.61: R8.1 34.14,46.74 C9.1
N$25
  Top 1.27: R11.2 27.94,32.41 R9.1 D4.A D5.C 29.46,35.05 28.04,33.63 R11.2 | R11.2 28.04,28.47 C11.2
N$26
  Top 0.508: U6.2 33.15,38.73 32.51,39.37 32.51,41.63 30.61,43.54 R17.2
  Top 0.61: R13.1 R17.2
N$27
  Top 1.27: C13.1 17.76,46.61 R12.1 R14.2
N$28
  Top 1.27: 52.07,87.63 50.8,86.36 PWR_TP.1
  Top 2.54: D1.~1 52.07,82.67 52.07,87.63 PWR.1
  Bottom 1.27: MOV.2 52.07,91.29 PWR.1
N$29
  Top 0.813: C8.1 14.46,52.68 R7.1
N$30
  Top 0.813: R7.2 14.46,55.52 C10.1 14.1,57.53 13.72,57.91 10.16,57.91 9.14,58.93 9.14,59.94 10.03,60.83 U5.7
N$31
  Top 1.016: 5V.A 54.38,58.22 R29.1
N$32
  Top 1.016: LED2.A 85.63,55.95 R31.1
N$33
  Top 0.813: C16.1 14.33,79.86 R16.1
N$34
  Top 0.813: U7.7 10.03,88.27 9.14,87.38 9.14,85.85 9.65,85.34 13.21,85.34 14.1,84.45 C17.1 14.25,82.7 R16.2
N$35
  Top 1.016: LED1.A 82.78,55.88 R30.1
N$36
  Top 0.61: 12V_TP1.2 24.13,76.96 25.79,75.3 U1.5
  Bottom 0.61: 12V_TP1.2 26.64,76.96 R32.1
N$37
  Top 0.406: TP3.1 68.33,72.39 71.37,69.34 71.37,57.78 JP5.12
  Bottom 0.406: U2.2 69.6,67.69 69.98,67.31 69.98,57.28 71.37,55.88 JP5.12
N$38  (via drill 0.35)
  Top 0.61: v32.51,78.74 33.21,78.04 33.47,78.04
  Top 0.813: v55.37,84.71 55.37,82.04 57.34,80.07
  Top 1.016: U1.1 32.63,77.34 32.77,77.34 33.47,78.04 38.1,82.68
  Top 1.27: 38.1,82.68 C2.1 | D1.+ 50.45,78.36 55.63,78.36 57.34,80.07 57.67,80.4 U3.1
  Top 2.54: C3.1 38.1,86.36 C2.1 38.83,83.4 D1.+
  Bottom 0.61: R32.2 31.11,77.34 v32.51,78.74
  Bottom 0.813: R33.2 58.17,87.5 v55.37,84.71
N$39
  Top 1.016: U3.2 59.38,84.52 60.2,85.34 64.52,85.34 67.82,85.34 68.83,85.34 69.09,85.09 D3.C 69.09,92.29 L2.P$1
N$40
  Top 0.508: R30.2 84.1,57.4 87,57.4 JP5.13
N$41
  Top 1.016: U1.2 30.92,80.41 D2.C 30.86,80.86 30.67,80.66 29.65,80.66 27,83.31 L1.P$1
N$42
  Bottom 1.016: X2.P$1 45.47,19.2 R27.1 C32.1 50.42,21.84 54.36,21.84 56.01,23.5 U14.26
N$43
  Top 0.508: R31.2 88.11,58.83 JP5.14
N$44
  Top 0.305: R24.2 82.3,6.1 83.95,7.75 U14.14
N$45
  Bottom 1.016: X2.P$2 45.47,16.36 R27.2 | R27.2 C31.2 | R27.2 52.3,16.36 58.55,22.61 U14.25
N$46  (via drill 0.35)
  Top 0.813: U3.5 64.51,79 v64.77,78.74
  Bottom 0.813: v64.77,78.74 64.77,85.5 | 64.77,85.5 R33.1 | 64.77,85.5 64.77,93.85 67.31,96.39 78.36,96.39 79.25,95.5 12V_TP2.2
N$47
  Top 0.305: JP16.12 90.68,41.91 90.68,43.69 89.92,44.45 79.88,44.45 78.99,45.34 78.87,45.47 U13.17
N$48
  Bottom 0.305: JP16.20 94.36,35.43 94.36,43.81 93.73,44.45 82.42,44.45 81.41,45.47 U13.16
N$49
  Bottom 0.305: JP16.19 93.6,37.21 93.6,41.27 92.96,41.91 74.68,41.91 73.79,42.8 U13.19
N$50
  Bottom 0.305: JP16.18 90.68,39.37 69.22,39.37 68.71,39.88 U13.21
N$51  (via drill 0.35)
  Top 0.305: R22.2 65.28,30.35 v66.04,29.59
  Bottom 0.305: v66.04,29.59 82.42,29.59 83.95,31.11 U13.14
N$52
  Bottom 1.016: X1.P$2 45.47,39.22 R26.2 | R26.2 C29.2 | R26.2 55.85,39.22 58.55,41.91 U13.25
N$53
  Bottom 1.016: X1.P$1 45.47,42.06 R26.1 C30.1 54.48,44.58 56.01,46.1 U13.26
N$55
  Bottom 0.305: U13.15 86.49,45.72 JP16.14
N$56
  Bottom 0.305: JP16.11 67.94,38.1 66.17,39.88 U13.22
N$58
  Top 0.305: U13.9 72.52,34.29 93.09,34.29 94.49,35.69 94.49,44.07 92.84,45.72 JP16.15
N$59
  Top 0.305: U13.8 72.52,36.83 92.96,36.83 93.6,37.47 93.6,42.67 93.09,43.18 JP16.16
N$60
  Top 0.305: JP16.17 90.68,39.37 67.06,39.37 63.63,35.94 U13.6
N$61
  Bottom 0.305: U13.5 62.74,34.67 87.76,34.67 JP16.9
N$62
  Bottom 0.305: JP16.8 90.68,31.75 90.68,36.2 90.04,36.83 58.29,36.83 56.01,34.54 U13.3
N$63
  Bottom 0.305: JP16.6 85.34,21.34 73.28,21.34 71.25,23.37 U14.20
N$64
  Top 0.305: U14.17 80.39,23.88 88.39,23.88 JP16.5
N$65
  Top 0.305: U14.16 85.22,29.21 90.3,29.21 90.68,28.83 90.68,22.1 91.19,21.59 93.22,21.59 93.6,21.21 93.6,15.62 93.22,15.24 JP16.27
N$66
  Top 0.305: JP16.26 90.68,19.05 74.55,19.05 73.79,19.81 U14.19
N$67
  Bottom 0.305: JP16.25 93.22,20.32 94.36,19.18 94.36,11.56 93.6,10.79 86.87,10.79 84.58,13.08 63.25,13.08 62.36,12.19 62.36,9.4 61.59,8.64 55.12,8.64 54.74,9.02 54.74,12.32 64.9,22.48 64.9,26.42 65.53,27.05 67.31,27.05 68.71,25.65 U14.21
N$68
  Top 0.305: U14.15 86.49,27.94 JP16.7
N$69
  Bottom 0.305: JP16.4 88.27,20.32 84.58,16.64 68.07,16.64 66.17,18.54 U14.22
N$70
  Top 0.305: JP16.28 90.68,13.97 65.53,13.97 63.63,15.88 U14.23
N$72
  Top 0.305: U14.9 72.77,11.68 84.45,11.68 86.11,10.03 94.49,10.03 95.38,10.92 95.38,27.05 94.49,27.94 JP16.22
N$73
  Top 0.305: PRIM_PREC_SELECT.2 58.67,3.81 59.82,2.67 69.98,2.67 73.41,6.1 R24.1
N$74
  Top 0.305: R22.1 58.52,32.99 U13.4
  Bottom 0.305: U13.4 61.09,35.56 JP16.10
N$76
  Bottom 0.305: JP16.24 95,22.86 95.38,22.48 95.38,11.05 94.23,9.91 86.36,9.91 84.58,11.68 64.26,11.68 63.63,11.05 U14.6
N$78
  Top 0.305: U14.8 71.25,12.7 84.84,12.7 86.61,10.92 93.73,10.92 94.36,11.56 94.36,24.51 93.47,25.4 JP16.23
OCD_CM
  Top 0.61: U10.3 32.38,14.61 29.97,12.19 29.97,9.96 28.3,8.28
  Top 1.016: R19.2 27.53,9.04 28.3,8.28 29.08,7.49 TP1.2
  Top 2.54: C20.1 15.73,9.02 R20.2 R19.2 19.04,9.29 D7.+
OCD_CMP
  Top 0.61: U10.7 40.01,15.88 | 40.01,15.88 40.89,14.99 40.89,11.94 39.5,10.54 37.21,10.54 34.16,7.49 TP1.4 | 40.01,15.88 41.66,17.53 41.66,26.92 OCD_EN.1
OCD_DETECT
  Bottom 0.406: JP5.11 73.53,58.42 75.06,56.9 75.06,54.86 74.3,54.1 71.37,54.1 69.09,56.39 69.09,61.21 67.94,62.36 63.42,62.36 62.53,63.25 U11.6
OCD_LIMIT  (via drill 0.35)
  Top 0.61: U10.2 32.13,15.88 32.07,15.81 U4.1 28.45,15.54 v28.45,12.7
  Bottom 0.61: v28.45,12.7 31.62,9.53 TP1.3
PRIMARY  (via drill 0.35)
  Top 0.508: v21.59,68.33 v21.59,59.44 | 25.91,52.96 29.46,49.4 34.67,49.4 35.69,48.39 38.61,48.39 38.61,42.04 37.34,40.77 37.34,39.24 37.85,38.73
  Top 0.61: TP2.3 25.91,52.96 | 37.85,38.73 U6.7
  Bottom 0.254: U9.13 41.91,68.33 44.32,70.74 47.88,70.74 52.83,65.79 U11.11
  Bottom 0.508: U9.13 39.12,68.33 35.18,72.26 28.7,72.26 27.3,70.87 27.3,68.71 26.92,68.33 U8.13 v21.59,68.33 | v21.59,59.44 24.26,59.44 25.91,57.78 TP2.3
SCL  (via drill 0.35)
  Top 0.61: v21.84,15.24 23.37,16.76 U4.5
  Bottom 0.61: JP5.A5 80.67,70.1 R6.2 80.52,57.63 80.52,53.34 83.31,50.55 89.92,50.55 91.44,49.02 I2C.1 95.5,49.02 96.52,48.01 96.52,10.41 95.02,8.91 92.86,8.91 86.36,2.41 21.21,2.41 20.32,3.3 20.32,13.72 v21.84,15.24
SDA  (via drill 0.35)
  Top 0.61: U4.4 23.56,17.71 20.83,20.45 v20.57,20.45
  Bottom 0.61: JP5.A4 82.14,69.03 R5.2 82.14,53.37 83.06,52.45 90.55,52.45 91.44,51.56 I2C.2 95,51.56 97.74,48.82 97.74,2.74 96.32,1.32 20.52,1.32 19.05,2.79 19.05,18.92 v20.57,20.45
TEST
  Top 0.508: R2.1 80.92,70.23 85.85,70.23 86.74,71.12 JP5.19 88.77,71.37 91.19,71.37 TEST.1
TRIG
  Top 0.508: JP5.20 89.92,73.66 92.46,76.2 TRIG.1 92.46,79.22 R1.1
UVLO  (via drill 0.35)
  Top 0.406: U12.1 38.41,56.39 37.47,56.39 v37.47,53.85
  Bottom 0.406: 37.08,51.69 38.23,50.55 43.69,50.55 46.61,53.47 46.61,56.77 47.37,57.53 UVLO_EN.2 | v37.47,53.85 37.08,53.47 37.08,53.44 37.08,51.69 | TP2.4 28.45,53.47 30.1,51.82 36.96,51.82 37.08,51.69
VCC  (via drill 0.35, 0.8)
  Top 0.406: U4.3 26.92,17.71 26.92,15.81 U4.6
  Top 0.508: R29.2 57.17,57.17 C5.1 | v45.09,44.96 45.97,44.07 45.97,36.83 v45.72,36.58
  Top 0.61: C18.2 37.47,17.4 37.72,17.14 U10.8 38.54,17.71 v39.62,18.8 | U4.3 28.17,19.66 C6.1 28.32,21.72 v28.45,21.84 | R13.2 25.25,46.63 v25.15,46.74 | C12.1 37.98,34.8 36.07,36.7 36.07,39.24 35.31,40.01 U6.1 33.98,40.13 33.98,41.47 34.29,41.78 v36.7,41.78
  Top 1.016: U14.18 C28.2 | TP3.4 60.71,76.58 62.87,78.74 62.8,78.74 U3.4 | v56.01,52.7 56.05,52.7 58.08,54.74 C5.1
  Top 1.27: R9.2 24.79,29.46 v22.35,29.46
  Bottom 0.305: v56.01,52.7 59.82,52.7 59.82,46.61 62.36,46.61 62.36,49.91 64.9,49.91 64.9,47.24
  Bottom 0.406: U2.5 66.6,68.33 67.18,68.33 67.56,67.94 67.56,65.4 C1.1 66.55,65.66 66.29,65.66 65.28,66.67 63.25,66.67 62.36,65.79 U11.4
  Bottom 1.524: 87.12,76.71 88.05,76.2 JP5.21 89.92,76.2
  pour Bottom (isolate 0.61, rank 4): 0,0 99.06,0 99.06,99.06 0,99.06

### Text on the board
tPlace: 12V | GND | + | D | - | 5V EN | ARDUINO / PRO / MINI | 12V EN | 12V | GND | B | 5V | A | INT | PHASE / SELECT | DRSSTC / DRIVER / Rev B | FB | UV | ACTV | 5V | GND | GND | PRI | INA | UVLO | SDA | SCL | ICM7216 | GND | OCD | PHASE / LEAD | ICM7216 | FREQ DISP> | GND | GND | LO | HI | PRIM / PREC | TRIP | CURR | LIMIT